# Altium schematic sheet IB_V2_AUDIO.SchDoc
size A2; SheetNumber: 4; SheetTotal: 5
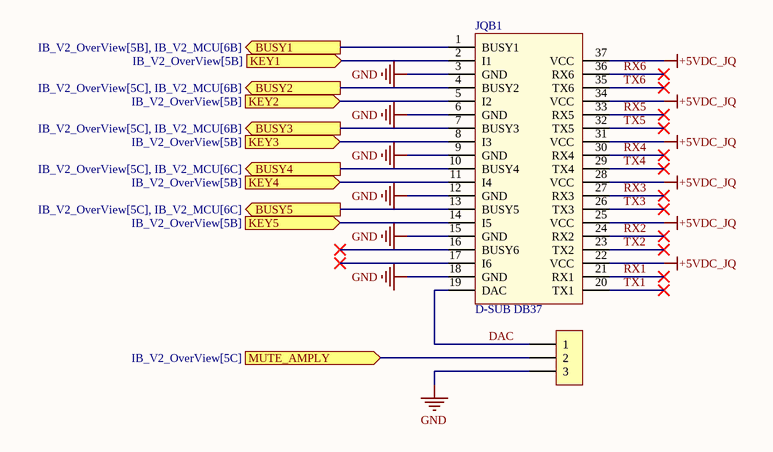
[diagram p0: IB_V2_AUDIO.SchDoc]

## Parts
H6  Header 3P 2.54 Duc Thang  [XH2.54M-3]  (value not drawn)
JQB1  D-SUB DB37  [JQ BOARD]

## Ports
BUSY1 (out, see IB_V2_OverView[5B], IB_V2_MCU[6B]), BUSY2 (out, see IB_V2_OverView[5C], IB_V2_MCU[6B]), BUSY3 (out, see IB_V2_OverView[5C], IB_V2_MCU[6B]), BUSY4 (out, see IB_V2_OverView[5C], IB_V2_MCU[6C]), BUSY5 (out, see IB_V2_OverView[5C], IB_V2_MCU[6C]), KEY1 (in, see IB_V2_OverView[5B]), KEY2 (in, see IB_V2_OverView[5B]), KEY3 (in, see IB_V2_OverView[5B]), KEY4 (in, see IB_V2_OverView[5B]), KEY5 (in, see IB_V2_OverView[5B]), MUTE_AMPLY (in, see IB_V2_OverView[5C])

## Nets
+5VDC_JQ: JQB1.22(VCC) JQB1.25(VCC) JQB1.28(VCC) JQB1.31(VCC) JQB1.34(VCC) JQB1.37(VCC)
GND: H6.3 JQB1.3(GND) JQB1.6(GND) JQB1.9(GND) JQB1.12(GND) JQB1.15(GND) JQB1.18(GND)
BUSY1: JQB1.1(BUSY1) ; port BUSY1
BUSY2: JQB1.4(BUSY2) ; port BUSY2
BUSY3: JQB1.7(BUSY3) ; port BUSY3
BUSY4: JQB1.10(BUSY4) ; port BUSY4
BUSY5: JQB1.13(BUSY5) ; port BUSY5
DAC: H6.1 JQB1.19(DAC)
KEY1: JQB1.2(I1) ; port KEY1
KEY2: JQB1.5(I2) ; port KEY2
KEY3: JQB1.8(I3) ; port KEY3
KEY4: JQB1.11(I4) ; port KEY4
KEY5: JQB1.14(I5) ; port KEY5
MUTE_AMPLY: H6.2 ; port MUTE_AMPLY
RX1: JQB1.21(RX1)
RX2: JQB1.24(RX2)
RX3: JQB1.27(RX3)
RX4: JQB1.30(RX4)
RX5: JQB1.33(RX5)
RX6: JQB1.36(RX6)
TX1: JQB1.20(TX1)
TX2: JQB1.23(TX2)
TX3: JQB1.26(TX3)
TX4: JQB1.29(TX4)
TX5: JQB1.32(TX5)
TX6: JQB1.35(TX6)

Not connected (* = marked no-connect by the designer): JQB1 16(BUSY6)* 17(I6)*

## Library data of the parts
H6 = Header 3P 2.54 Duc Thang: Cắm; Ten_Linh_Kien: Header 3P XH2.54-3P Đực Thẳng; Don_Vi: Con; Ma_Hang: MH001292; Chung_Loai: Cắm
JQB1 = JQ8900: DB37-2.77 Cái Thẳng 2 Hàng chân hàn PCB